# Altium project Rover_Motor_Driver.PrjPcb
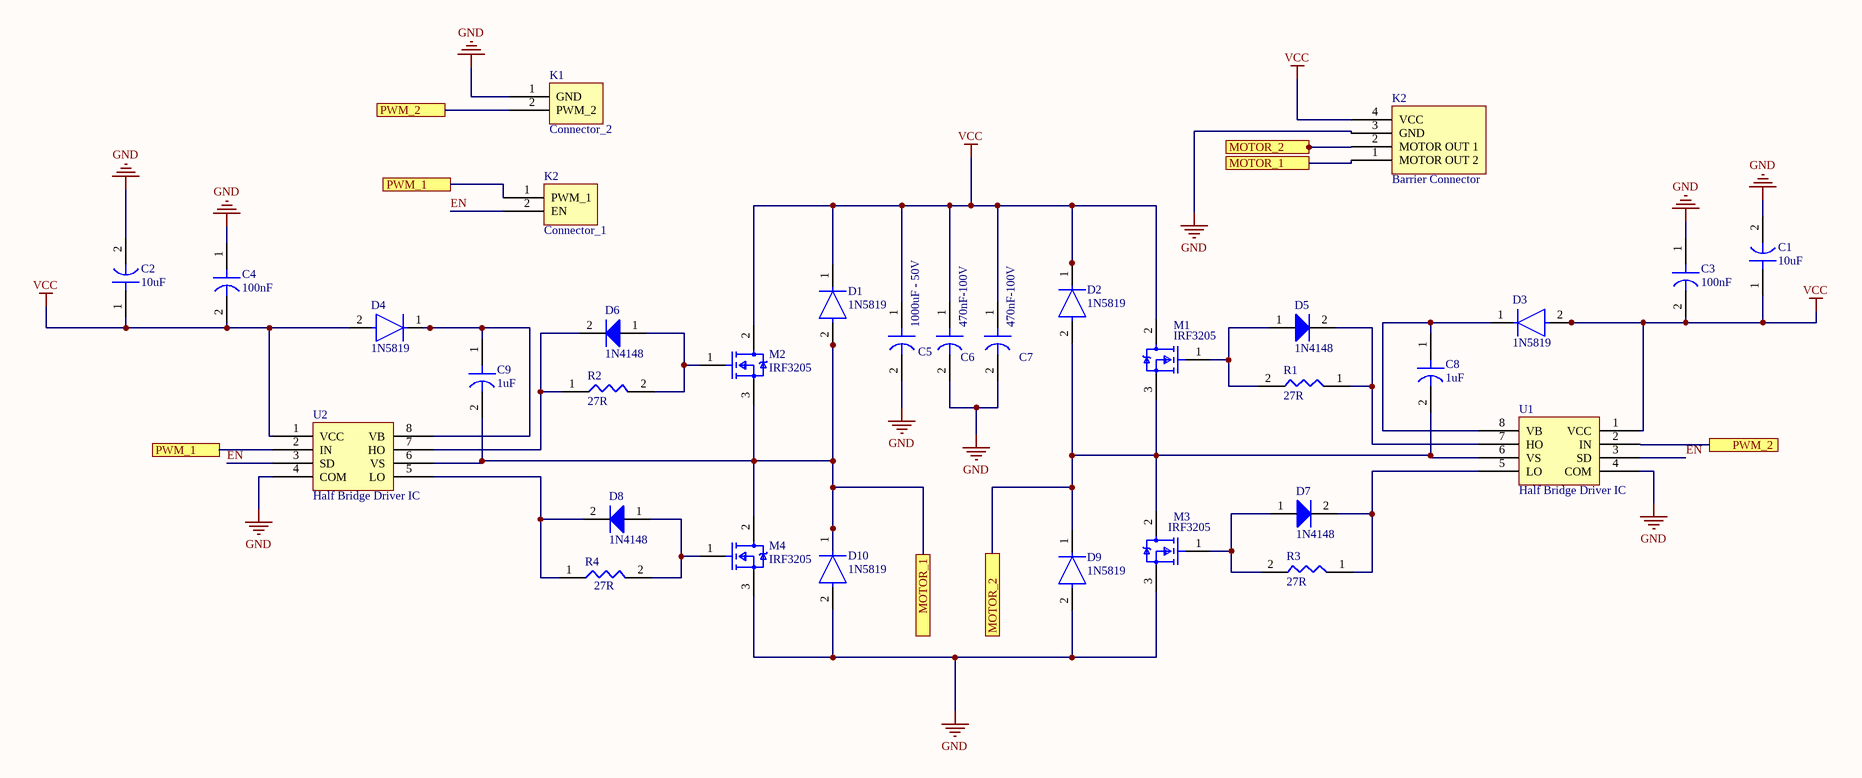
[diagram p0: Rover_Motor_Driver.SchDoc]
1 sheet, 32 parts. Net scope: flat (ports and power ports of the same name join across sheets).
Board file: Rover_Motor_Driver.PcbDoc

## Sheet Rover_Motor_Driver.SchDoc
size A3; CompanyName: GTU Rover Team; DrawnBy: Ahmet Ali Tilkicioğlu; SheetNumber: 1; SheetTotal: 1

### Parts
(Parts that share a designator on the sheet are numbered #1, #2 ... from top to bottom, then left to right.)
C1  10uF  [C1206]
C2  10uF  [C1206]
C3  100nF  [C1206]
C4  100nF  [C1206]
C5  1000uF - 50V  [1000uF 50V Capacitor]
C6  470nF-100V  [C1206]
C7  470nF-100V  [C1206]
C8  1uF  [C1206]
C9  1uF  [C1206]
D1  1N5819  [1N5819]
D2  1N5819  [1N5819]
D3  1N5819  [1N5819]
D4  1N5819  [1N5819]
D5  1N4148  [1N4148]
D6  1N4148  [1N4148]
D7  1N4148  [1N4148]
D8  1N4148  [1N4148]
D9  1N5819  [1N5819]
D10  1N5819  [1N5819]
K1  Connector_2  [DG126-Konnektör]
K2#1  Barrier Connector  [DG55C]
K2#2  Connector_1  [DG126-Konnektör]
M1  IRF3205  [IRF3205]
M2  IRF3205  [IRF3205]
M3  IRF3205  [IRF3205]
M4  IRF3205  [IRF3205]
R1  27R  [R0603]
R2  27R  [R0603]
R3  27R  [R0603]
R4  27R  [R0603]
U1  Half Bridge Driver IC  [IR2104]
U2  Half Bridge Driver IC  [IR2104]

### Ports
MOTOR_1 (see Rover_Motor_Driver[4C]), MOTOR_1 (see Rover_Motor_Driver[6B]), MOTOR_2 (see Rover_Motor_Driver[5C]), MOTOR_2 (see Rover_Motor_Driver[6B]), PWM_1 (see Rover_Motor_Driver[1C]), PWM_1 (see Rover_Motor_Driver[2B]), PWM_2 (see Rover_Motor_Driver[2B]), PWM_2 (see Rover_Motor_Driver[7C])

### Nets
GND: C1.2 C2.2 C3.1 C4.1 C5.2 C6.2 C7.2 D9.2(A) D10.2(A) K1.1(GND) K2#1.3(GND) M3.3(S) M4.3(S) U1.4(COM) U2.4(COM)
VCC: C1.1 C2.1 C3.2 C4.2 C5.1 C6.1 C7.1 D1.1(C) D2.1(C) D3.2(A) D4.2(A) K2#1.4(VCC) M1.2(D) M2.2(D) U1.1(VCC) U2.1(VCC)
EN: K2#2.2(EN) U1.3(SD) U2.3(SD)
NetC8_1: C8.1 D3.1(C) U1.8(VB)
NetC8_2: C8.2 D2.2(A) D9.1(C) K2#1.2(MOTOR_OUT_1) M1.3(S) M3.2(D) U1.6(VS) ; port MOTOR_2
NetC9_1: C9.1 D4.1(C) U2.8(VB)
NetC9_2: C9.2 D1.2(A) D10.1(C) K2#1.1(MOTOR_OUT_2) M2.3(S) M4.2(D) U2.6(VS) ; port MOTOR_1
NetD5_1: D5.1(A) M1.1(G) R1.2
NetD5_2: D5.2(K) R1.1 U1.7(HO)
NetD6_1: D6.1(A) M2.1(G) R2.2
NetD6_2: D6.2(K) R2.1 U2.7(HO)
NetD7_1: D7.1(A) M3.1(G) R3.2
NetD7_2: D7.2(K) R3.1 U1.5(LO)
NetD8_1: D8.1(A) M4.1(G) R4.2
NetD8_2: D8.2(K) R4.1 U2.5(LO)
NetK1_2: K1.2(PWM_2) U1.2(IN) ; port PWM_2
NetK2#2_1: K2#2.1(PWM_1) U2.2(IN) ; port PWM_1

### Library data of the parts
K2#1 = DG55C
U1 U2 = IR2104